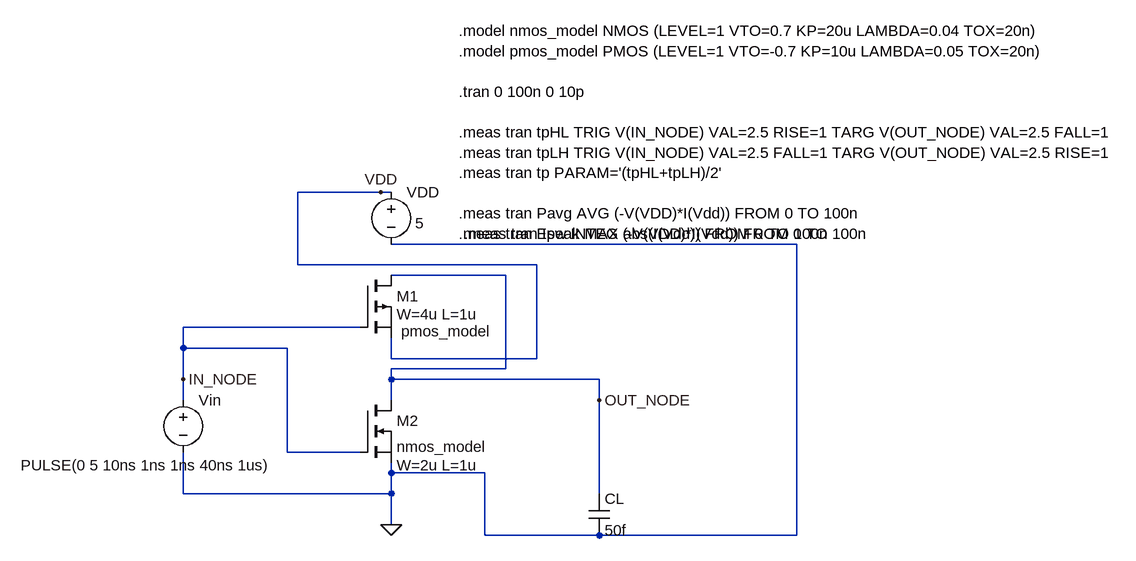
[diagram p0: schematic cmos_inverter.asc]
cmos_inverter.asc, the LTspice schematic file:
Version 4.1
SHEET 1 1576 728
WIRE 400 -176 272 -176
WIRE 416 -176 400 -176
WIRE 1040 -96 416 -96
WIRE 272 -64 272 -176
WIRE 640 -64 272 -64
WIRE 592 -48 416 -48
WIRE 368 32 96 32
WIRE 96 64 96 32
WIRE 256 64 96 64
WIRE 416 80 416 48
WIRE 640 80 640 -64
WIRE 640 80 416 80
WIRE 592 96 592 -48
WIRE 592 96 416 96
WIRE 96 112 96 64
WIRE 416 112 416 96
WIRE 736 112 416 112
WIRE 96 144 96 112
WIRE 416 144 416 112
WIRE 736 144 736 112
WIRE 256 224 256 64
WIRE 368 224 256 224
WIRE 416 256 416 240
WIRE 560 256 416 256
WIRE 96 288 96 224
WIRE 416 288 416 256
WIRE 416 288 96 288
WIRE 736 288 736 144
WIRE 416 336 416 288
WIRE 560 352 560 256
WIRE 736 352 560 352
WIRE 1040 352 1040 -96
WIRE 1040 352 736 352
FLAG 416 336 0
FLAG 400 -176 VDD
FLAG 96 112 IN_NODE
FLAG 736 144 OUT_NODE
SYMBOL voltage 416 -192 R0
WINDOW 123 0 0 Left 0
WINDOW 39 0 0 Left 0
WINDOW 3 37 64 Left 2
SYMATTR Value 5
SYMATTR InstName VDD
SYMBOL voltage 96 128 R0
WINDOW 123 0 0 Left 0
WINDOW 39 0 0 Left 0
WINDOW 3 -250 116 Left 2
SYMATTR Value PULSE(0 5 10ns 1ns 1ns 40ns 1us)
SYMATTR InstName Vin
SYMBOL cap 720 288 R0
SYMATTR InstName CL
SYMATTR Value 50f
SYMBOL pmos 368 -48 R0
WINDOW 3 63 86 Left 2
WINDOW 39 56 60 Left 2
SYMATTR Value pmos_model
SYMATTR SpiceLine W=4u L=1u
SYMATTR InstName M1
SYMBOL nmos 368 144 R0
WINDOW 39 56 100 Left 2
SYMATTR SpiceLine W=2u L=1u
SYMATTR InstName M2
SYMATTR Value nmos_model
TEXT 520 -424 Left 2 !.model nmos_model NMOS (LEVEL=1 VTO=0.7 KP=20u LAMBDA=0.04 TOX=20n)\n.model pmos_model PMOS (LEVEL=1 VTO=-0.7 KP=10u LAMBDA=0.05 TOX=20n)\n \n.tran 0 100n 0 10p\n \n.meas tran tpHL TRIG V(IN_NODE) VAL=2.5 RISE=1 TARG V(OUT_NODE) VAL=2.5 FALL=1\n.meas tran tpLH TRIG V(IN_NODE) VAL=2.5 FALL=1 TARG V(OUT_NODE) VAL=2.5 RISE=1\n.meas tran tp PARAM='(tpHL+tpLH)/2'\n \n.meas tran Pavg AVG (-V(VDD)*I(Vdd)) FROM 0 TO 100n\n.meas tran Esw INTEG (-V(VDD)*I(Vdd)) FROM 0 TO 100n
TEXT 528 -112 Left 2 !.meas tran Ipeak MAX abs(I(Vdd)) FROM 0 TO 100n

The netlist it stands for:
* cmos_inverter.asc
VDD VDD 0 5
Vin IN_NODE 0 PULSE(0 5 10ns 1ns 1ns 40ns 1us)
CL OUT_NODE 0 50f
M1 OUT_NODE IN_NODE VDD VDD pmos_model W=4u L=1u
M2 OUT_NODE IN_NODE 0 0 nmos_model W=2u L=1u
.model NMOS NMOS
.model PMOS PMOS
.lib standard.mos
.model nmos_model NMOS (LEVEL=1 VTO=0.7 KP=20u LAMBDA=0.04 TOX=20n)
.model pmos_model PMOS (LEVEL=1 VTO=-0.7 KP=10u LAMBDA=0.05 TOX=20n)
.tran 0 100n 0 10p
.meas tran tpHL TRIG V(IN_NODE) VAL=2.5 RISE=1 TARG V(OUT_NODE) VAL=2.5 FALL=1
.meas tran tpLH TRIG V(IN_NODE) VAL=2.5 FALL=1 TARG V(OUT_NODE) VAL=2.5 RISE=1
.meas tran tp PARAM='(tpHL+tpLH)/2'
.meas tran Pavg AVG (-V(VDD)*I(Vdd)) FROM 0 TO 100n
.meas tran Esw INTEG (-V(VDD)*I(Vdd)) FROM 0 TO 100n
.meas tran Ipeak MAX abs(I(Vdd)) FROM 0 TO 100n
.backanno
.end